# EAGLE design PCB-Sensores (EAGLE 7.2.0)
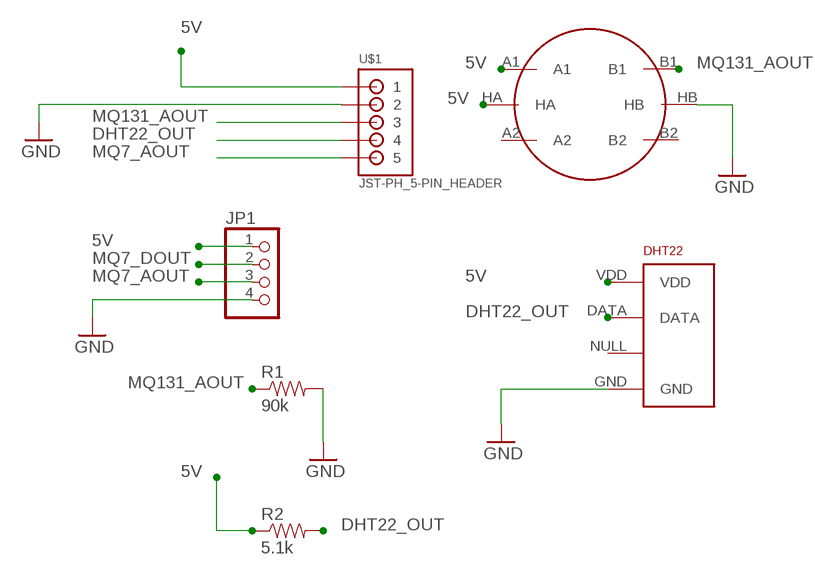
[diagram p0: schematic, sheet 1]

## Parts
DHT22  RHT03_DHT-22_AM2302  [RHT03_DHT-22]
JP1  PINHD-1X4  [1X04]
MQ131  METHANE_SENSOR  [MQ-3]
R1  90k  10KOHM-1/4W-1%(PTH)HORIZ-KIT  [AXIAL-0.3EZ]
R2  5.1k  10KOHM-1/4W-1%(PTH)HORIZ-KIT  [AXIAL-0.3EZ]
U$1  JST-PH_5-PIN_HEADER  [JST_B5B-PH_HEADER]

## Nets
5V: DHT22.VDD JP1.1 MQ131.A1 MQ131.HA R2.P$1 U$1.P1
DHT22_OUT: DHT22.DATA R2.P$2 U$1.P4
GND: DHT22.GND JP1.4 MQ131.HB R1.P$2 U$1.P2
MQ7_AOUT: JP1.3 U$1.P5
MQ7_DOUT: JP1.2
MQ131_AOUT: MQ131.B1 R1.P$1 U$1.P3
Unconnected: DHT22.NULL MQ131.A2 MQ131.B2

## Library data of the parts
DHT22 = RHT03_DHT-22_AM2302:RHT03_DHT-22_AM2302: RHT03 / DHT-22 / AM2302 Packages and symbol for the RHT03 / DHT-22 relative humidity and temperature sensor. Note: The AM2302 is a wired version of the DHT-22 which typically requires less clearance and is thus provided as a separate package.; PROD_ID: SEN-10167
JP1 = pinhead:PINHD-1X4: PIN HEADER
MQ131 = SparkFun-Sensors:METHANE_SENSOR: MQ-4 Methane Gas Sensor SEN-09404
R1 R2 = SparkFun-Resistors:10KOHM-1/4W-1%(PTH): RES-12183; PROD_ID: RES-12183; VALUE: 10k
U$1 = SRG:JST-PH_5-PIN_HEADER: 5-pin JST PH Shrouded Header, top entry P/N B5B-PH-K-S Mating connector PHR-5 Mating cable assembly: Sparkfun PRT-09917 <http://www.sparkfun.com/products/9917>

## Board
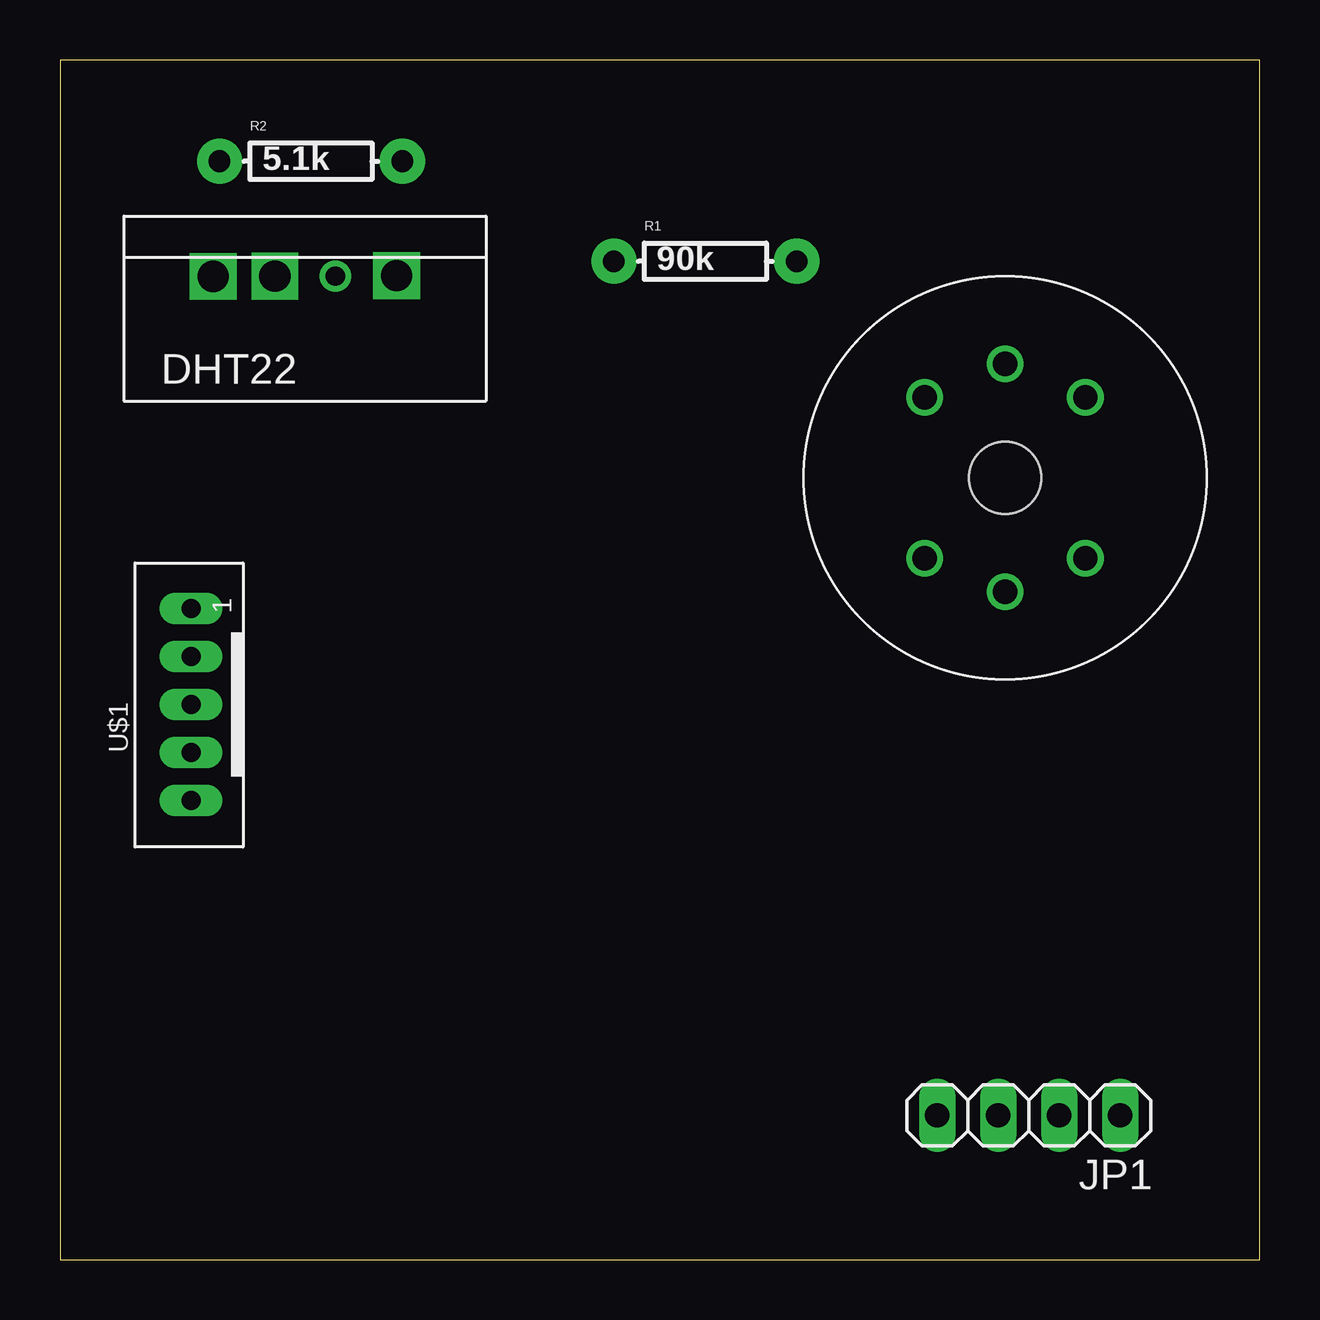
[diagram p1: board, top side]
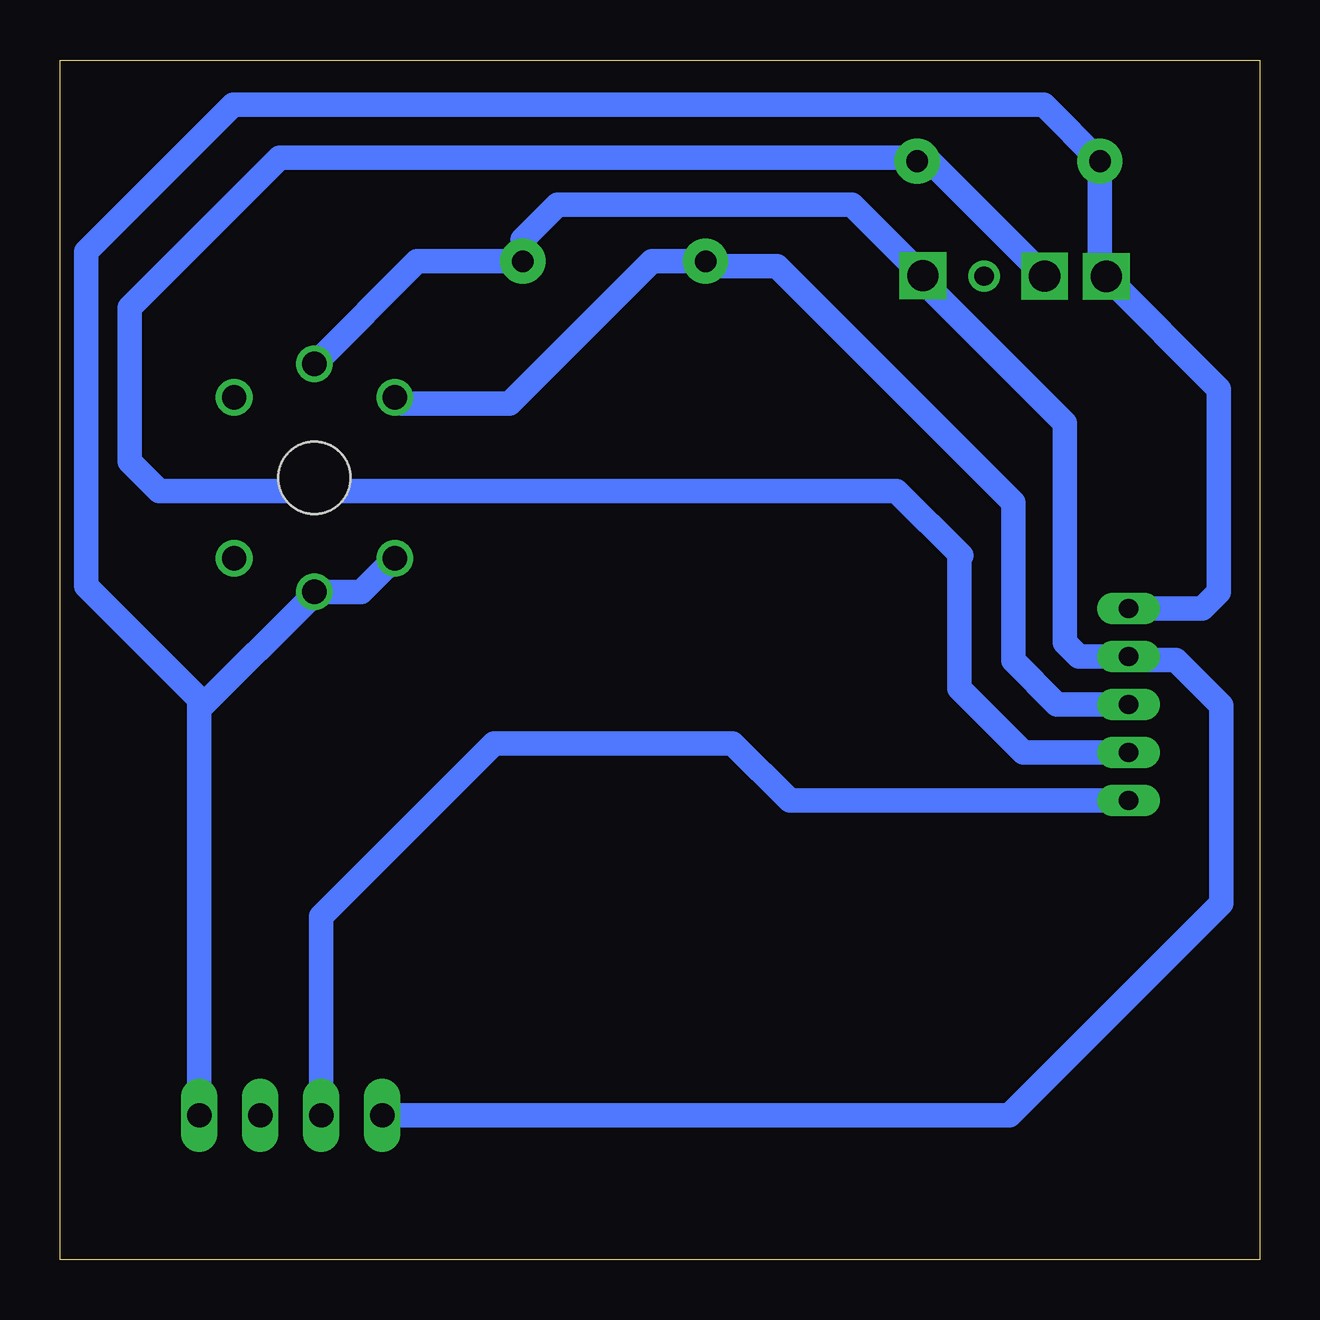
[diagram p2: board, bottom side, seen from below]

Size 50 x 50 mm. Coordinates in mm from the lower left corner, seen from the top.
Outline: 0,0 50,0 50,50 0,50 0,0
Copper layers (1*16): Top 0.035mm / dielectric 1.5mm / Bottom 0.035mm
Design rules "default": minimum track width 10mil, minimum drill 24mil, track to track 8mil, track to pad 8mil, pad to pad 8mil, via to via 8mil, smd to smd 8mil, copper to edge 40mil, drill to drill 8mil, minimum pad ring 10mil, minimum via ring 8mil, stop-mask expansion 4mil, vias tented up to drill 0mil, thermal gap 10mil

### Footprints (pad centres in the part's own frame; a part is rotated, then mirrored left to right if it is on the bottom)
RHT03_DHT-22 = drill 0.8: DATA -1.27,0; GND 3.81,0; NULL 1.27,0 | drill 0.8 octagon: VDD -3.81,0
1X04 = drill 1.016 long: 1 -3.81,0; 2 -1.27,0; 3 1.27,0; 4 3.81,0
MQ-3 = drill 1.016: A1 -3.35,3.35; A2 -3.35,-3.35; B1 3.35,3.35; B2 3.35,-3.35; HA -4.75,0; HB 4.75,0 | hole 3: 0,0
AXIAL-0.3EZ = drill 0.9 pad 1.88: P$1 -3.81,0; P$2 3.81,0
JST_B5B-PH_HEADER = drill 0.8 long: P1 4,0.048; P2 2,0.048; P3 0,0.048; P4 -2,0.048; P5 -4,0.048

### Placement (x,y rotation side)
DHT22  10.21,40.99 0 top
JP1  40.38,6.01 180 top
MQ131  39.39,32.58 90 top
R1  26.9,41.61 0 top
R2  10.46,45.78 0 top
U$1  5.51,23.14 90 top

### Tracks (layer width: path | path; a pad name or v marks a point on that pad's centre or on a via)
5V  (via drill 1.3)
  Bottom 1.016: MQ131.A1 37.44,27.83 MQ131.HA 39.39,27.75 44.19,22.95 | U$1.P1 2.38,27.14 1.7,27.82 1.7,36.29 v6.39,40.98 DHT22.VDD 6.65,40.99 R2.P$1 9,48.13 42.79,48.13 48.91,42.01 48.91,28.08 44.19,23.36 44.19,22.95 | JP1.1 44.19,22.95
DHT22_OUT
  Bottom 0.406: R2.P$2 14.62,45.78 14.62,45.93
  Bottom 1.016: DHT22.DATA 13.88,45.93 14.62,45.93 40.85,45.93 47.1,39.68 47.1,33.27 45.87,32.04 15.13,32.04 12.43,29.34 12.51,29.26 12.51,23.8 9.85,21.14 U$1.P4
GND
  Bottom 1.016: MQ131.HB 35.11,41.61 R1.P$2 30.71,42.51 29.26,43.96 16.99,43.96 DHT22.GND 14.02,40.77 8.11,34.86 8.11,25.71 7.54,25.14 U$1.P2 5.31,24.99 3.5,24.99 1.6,23.09 1.6,14.84 10.43,6.01 JP1.4
MQ7_AOUT
  Bottom 1.016: JP1.3 39.11,14.31 31.9,21.52 21.96,21.52 19.58,19.14 U$1.P5
MQ131_AOUT
  Bottom 1.016: U$1.P3 8.44,23.14 10.26,24.96 10.26,31.55 20.12,41.41 22.89,41.41 R1.P$1 25.33,41.61 31.27,35.67 35.78,35.67 MQ131.B1
N$7  (via drill 1.3)
  other vias: 8.96,40.99
N$8  (via drill 1.3)
  other vias: 14.03,41.01